# EAGLE design MRCS-Hankscraft-Contact (EAGLE 7.7.0)
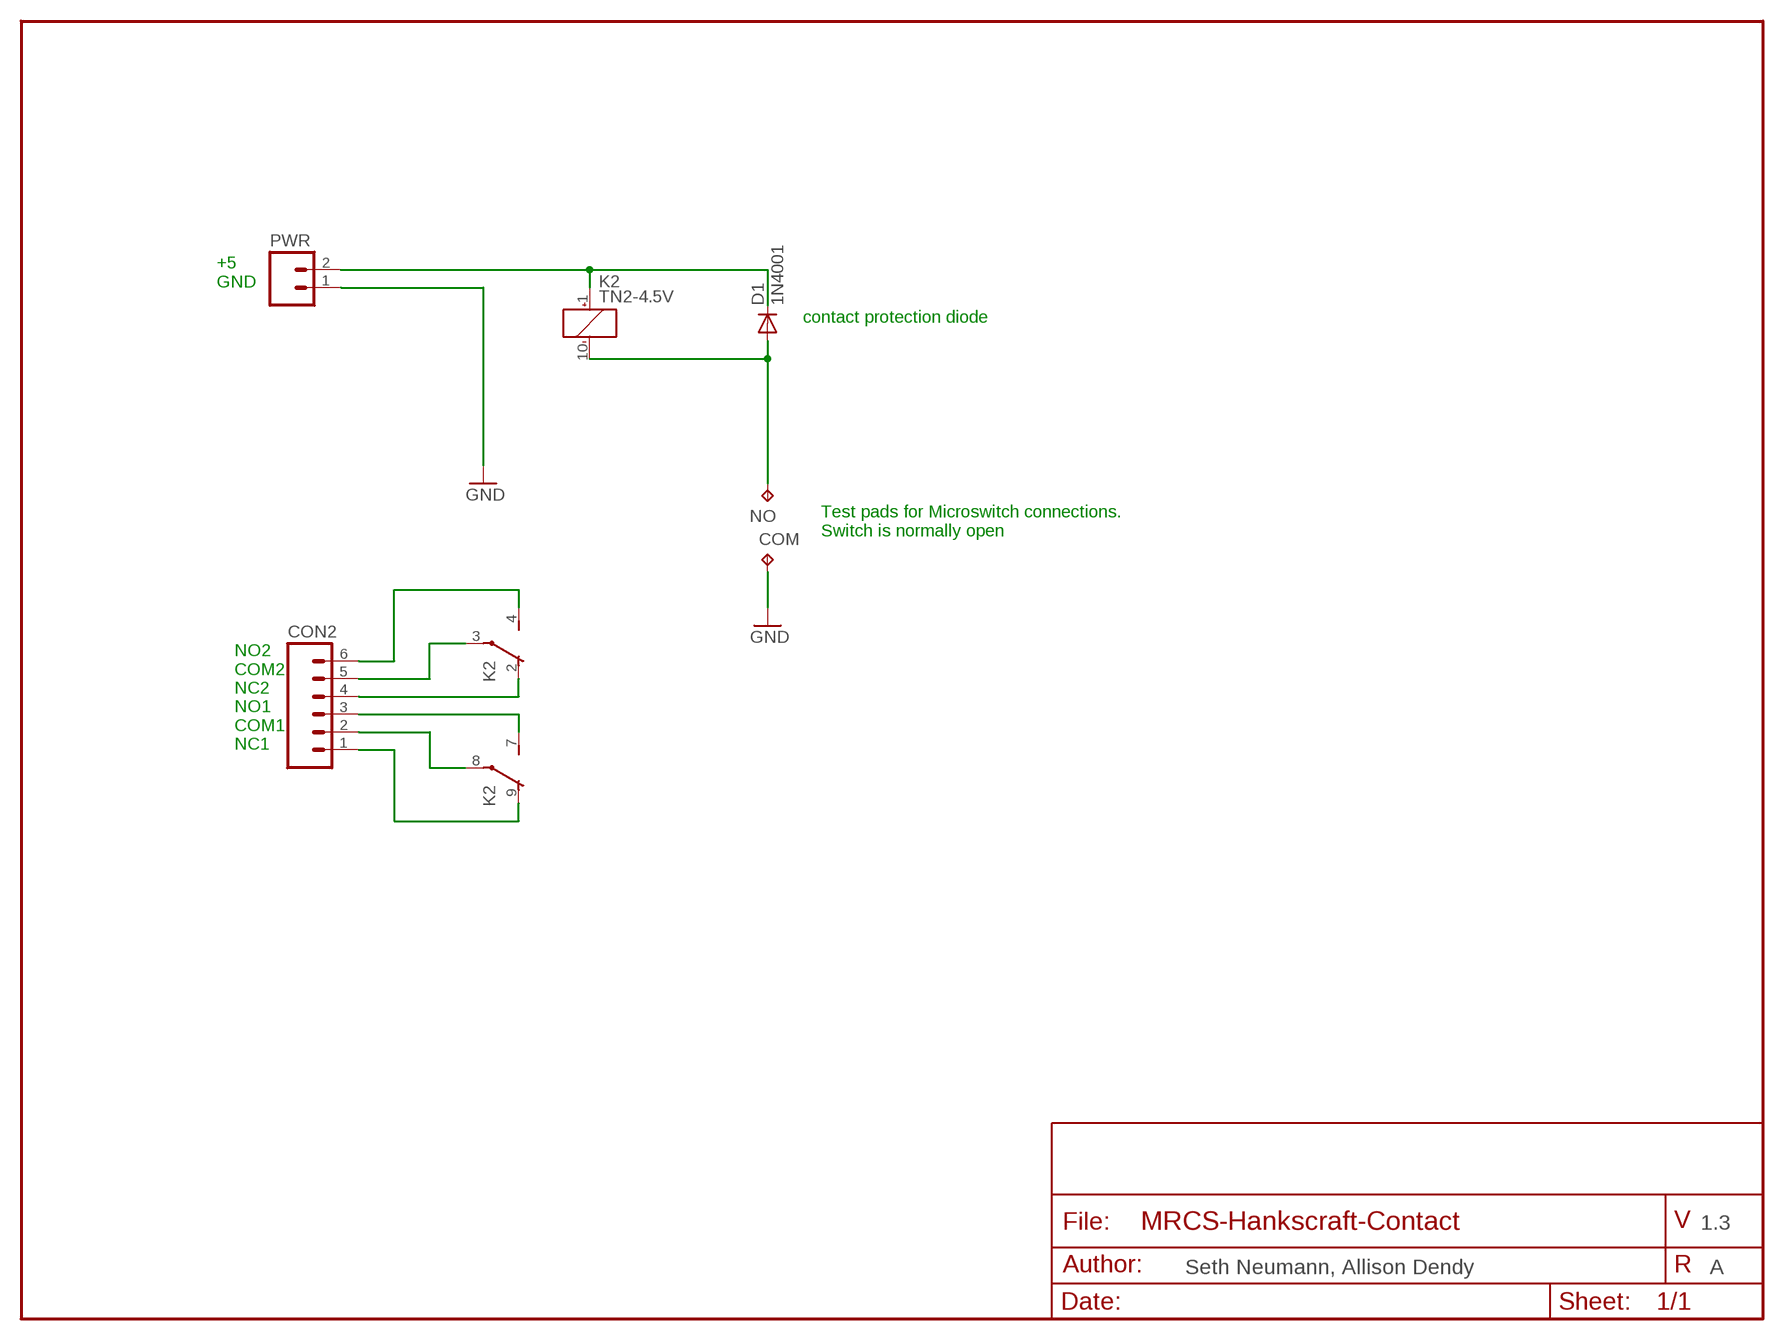
[diagram p0: schematic, sheet 1]

## Parts
COM  TPPAD1-13  [P1-13]
CON2  CONNECTOR-M06LOCK  [1X06_LOCK]
D1  1N4001  DIODEPTH  [DIODE-1N4001]
K2  TN2-4.5V  [TN2]
NO  TPPAD1-13  [P1-13]
PWR  CONNECTOR-M021X02-LOCK  [1X02_LOCK]

## Nets
GND: COM.TP PWR.1(A)
N$1: CON2.2 K2.8(2:P)
N$2: CON2.3 K2.7(2:S)
N$3: CON2.1 K2.9(2:O)
N$4: CON2.4 K2.2(1:O)
N$5: CON2.5 K2.3(1:P)
N$6: CON2.6 K2.4(1:S)
N$7: D1.C K2.1(-:+) PWR.2(B)
N$9: D1.A K2.10(-:-) NO.TP

## Notes on the sheet
- +5
  GND
- contact protection diode
- Test pads for Microswitch connections. 
  Switch is normally open
- NO2
  COM2
  NC2
  NO1
  COM1
  NC1
- 1.3
- Seth Neumann, Allison Dendy | A

## Library data of the parts
COM NO = testpad:TP: Test pad
CON2 = SPCoast:CONNECTOR-M06: Header 6 Standard 6-pin 0.1" header
D1 = SPCoast:DIODE: Diode These are standard reverse protection diodes and small signal diodes. SMA package can handle up to about 1A. SOD-323 can handle about 200mA. What the SOD-323 package when ordering, there are some mfgs out there that are 5-pin packages.
K2 = relay:TN2?-*: SLIM POLARIZED RELAY NAiS Source: http://www.mew-europe.com/.. en_ds_61019_0000.pdf; MF: AROMAT/ MATSUSHITA; MPN: TN2-4.5V; OC_FARNELL: 1231845; OC_NEWARK: 64K3188
PWR = SPCoast:CONNECTOR-M02: PHOENIX CONNECTOR

## Board
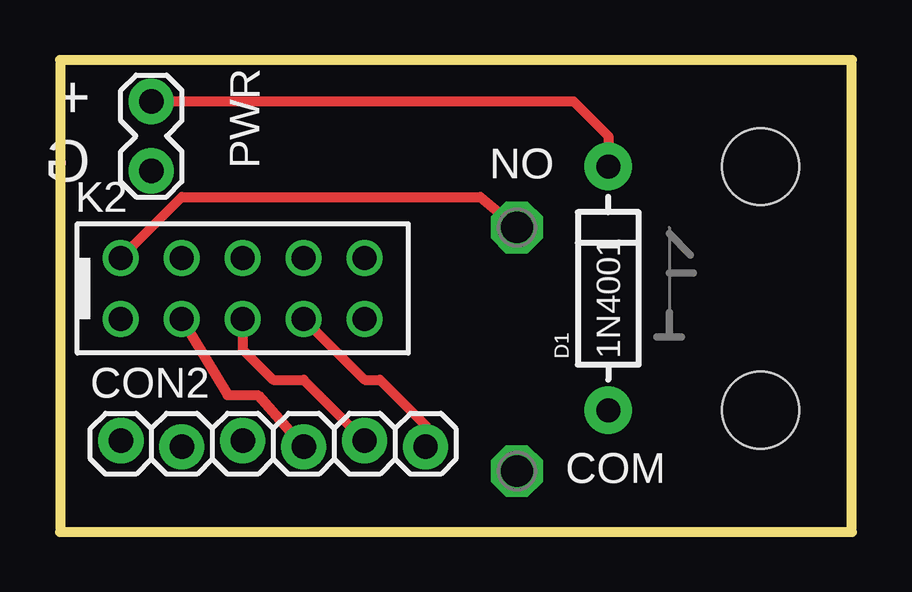
[diagram p1: board, top side]
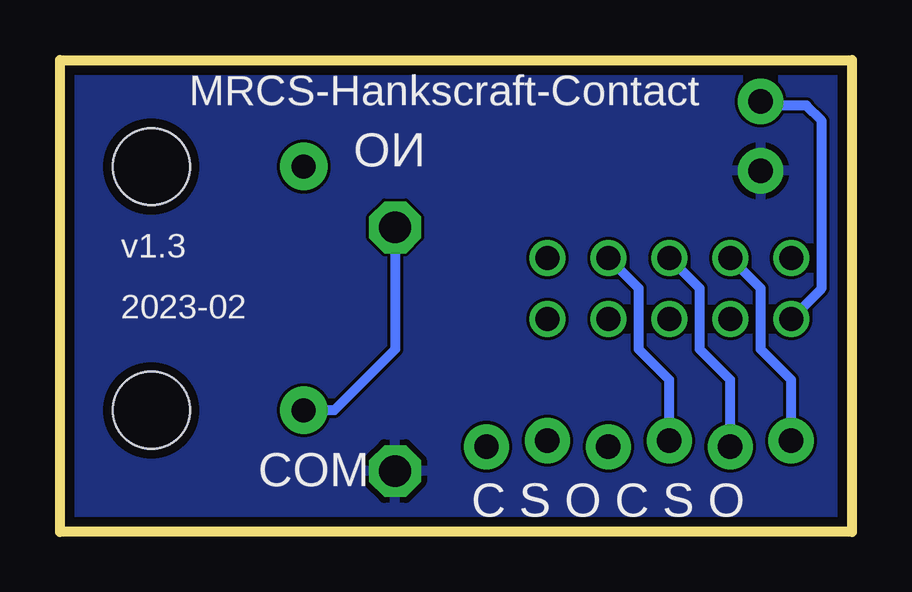
[diagram p2: board, bottom side, seen from below]

Size 33.02 x 19.68 mm. Coordinates in mm from the lower left corner, seen from the top.
Outline: 0,0 33.02,0 33.02,19.68 0,19.68 0,0
Copper layers (1*16): Top 0.035mm / dielectric 1.5mm / Bottom 0.035mm
Design rules "default *": minimum track width 5mil, minimum drill 0.2mm, track to track 5mil, track to pad 5mil, pad to pad 5mil, via to via 5mil, smd to smd 5mil, copper to edge 0.4mm, drill to drill 5mil, minimum pad ring 3mil, minimum via ring 3mil, stop-mask expansion 4mil, vias tented up to drill 0mil, thermal gap 10mil
Holes 3.2 mm at 29.21,15.24 29.21,5.08

### Footprints (pad centres in the part's own frame; a part is rotated, then mirrored left to right if it is on the bottom)
P1-13 = drill 1.321 pad 2.159 octagon: TP 0,0
1X06_LOCK = drill 1.016 pad 1.88: 1 0,0; 2 2.54,-0.254; 3 5.08,0; 4 7.62,-0.254; 5 10.16,0; 6 12.7,-0.254
DIODE-1N4001 = drill 1 pad 1.981: A 5.08,0; C -5.08,0
TN2 = drill 1: 1 -5.08,-1.27; 2 -2.54,-1.27; 3 0,-1.27; 4 2.54,-1.27; 5 5.08,-1.27; 6 5.08,1.27; 7 2.54,1.27; 8 0,1.27; 9 -2.54,1.27; 10 -5.08,1.27
1X02_LOCK = drill 1.016 pad 1.88: 1 -0.178,0; 2 2.718,0

### Placement (x,y rotation side)
COM  19.05,2.54 0 top
CON2  2.54,3.81 0 top
D1  22.86,10.16 270 top
K2  7.62,10.16 0 top
NO  19.05,12.7 0 top
PWR  3.81,15.24 90 top
U$1  [MRCSLOGOTOP]  24.13,7.62 0 top

### Tracks (layer width: path | path; a pad name or v marks a point on that pad's centre or on a via)
GND
  pour Bottom: 0,0 33.02,0 33.02,19.68 0,19.68
N$1
  Bottom 0.406: CON2.2 5.08,6.35 6.35,7.62 6.35,10.16 K2.8
N$2
  Bottom 0.406: CON2.3 7.62,6.35 8.89,7.62 8.89,10.16 K2.7
N$3
  Bottom 0.406: CON2.1 2.54,6.35 3.81,7.62 3.81,10.16 K2.9
N$4
  Top 0.406: K2.2 6.99,5.71 8.26,5.71 CON2.4
N$5
  Top 0.406: K2.3 7.62,7.62 8.89,6.35 10.16,6.35 CON2.5
N$6
  Top 0.406: K2.4 12.7,6.35 13.34,6.35 15.24,4.45 CON2.6
N$7
  Top 0.406: PWR.2 21.41,17.96 22.86,16.51 D1.C
  Bottom 0.406: K2.1 1.27,10.16 1.27,17.14 1.91,17.78 3.63,17.78 PWR.2
N$9
  Top 0.406: K2.10 5.08,13.97 17.53,13.97 NO.TP
  Bottom 0.406: NO.TP 19.05,7.62 21.59,5.08 D1.A

### Text on the board
tPlace: + / G
bPlace: NO | v1.3 | 2023-02 | COM | C S O C S O
_tNames: PWR | NO | K2 | D1 | CON2 | COM